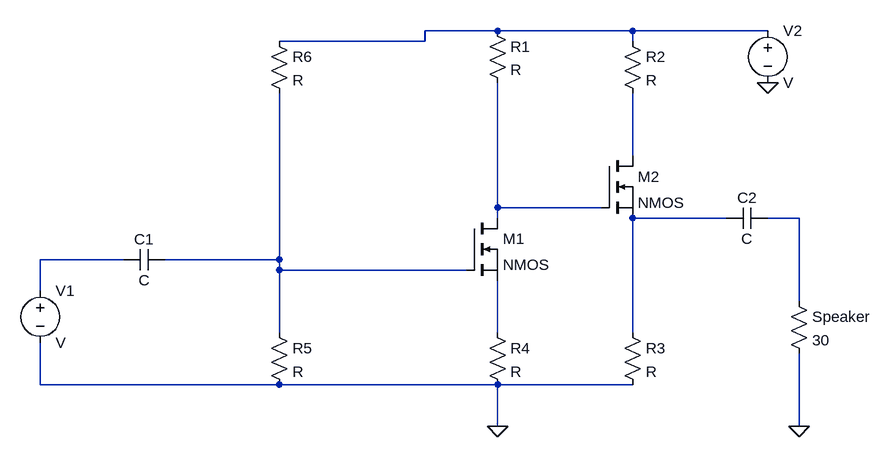
[diagram p0: schematic Amplifier_Draft_v1.asc]
Amplifier_Draft_v1.asc, the LTspice schematic file:
Version 4
SHEET 1 880 680
WIRE 176 -192 64 -192
WIRE 384 -192 176 -192
WIRE 592 -192 384 -192
WIRE 64 -176 64 -192
WIRE 64 -176 -160 -176
WIRE 384 -176 384 -192
WIRE 384 0 384 -96
WIRE 176 80 176 -112
WIRE 336 80 176 80
WIRE 176 96 176 80
WIRE 528 96 384 96
WIRE 640 96 592 96
WIRE -400 160 -528 160
WIRE -160 160 -160 -96
WIRE -160 160 -336 160
WIRE -160 176 -160 160
WIRE 128 176 -160 176
WIRE -528 208 -528 160
WIRE 640 224 640 96
WIRE -160 272 -160 176
WIRE 176 272 176 192
WIRE 384 272 384 96
WIRE -528 352 -528 288
WIRE -160 352 -528 352
WIRE 176 352 -160 352
WIRE 384 352 176 352
WIRE 176 416 176 352
WIRE 640 416 640 304
FLAG 176 416 0
FLAG 640 416 0
FLAG 592 -112 0
SYMBOL nmos 128 96 R0
SYMATTR InstName M1
SYMBOL nmos 336 0 R0
SYMATTR InstName M2
SYMBOL res 160 -208 R0
SYMATTR InstName R1
SYMBOL res 368 -192 R0
SYMATTR InstName R2
SYMBOL res 368 256 R0
SYMATTR InstName R3
SYMBOL res 160 256 R0
SYMATTR InstName R4
SYMBOL res -176 256 R0
SYMATTR InstName R5
SYMBOL res -176 -192 R0
SYMATTR InstName R6
SYMBOL cap -336 144 R90
WINDOW 0 0 32 VBottom 2
WINDOW 3 32 32 VTop 2
SYMATTR InstName C1
SYMBOL cap 592 80 R90
WINDOW 0 0 32 VBottom 2
WINDOW 3 32 32 VTop 2
SYMATTR InstName C2
SYMBOL voltage -528 192 R0
SYMATTR InstName V1
SYMBOL voltage 592 -208 R0
SYMATTR InstName V2
SYMBOL res 624 208 R0
SYMATTR InstName Speaker
SYMATTR Value 30

The netlist it stands for:
* Amplifier_Draft_v1.asc
M1 N003 N007 N008 N008 NMOS
M2 N002 N003 N004 N004 NMOS
R1 N001 N003 R
R2 N001 N002 R
R3 N004 0 R
R4 N008 0 R
R5 N007 0 R
R6 N001 N007 R
C1 N007 N006 C
C2 N005 N004 C
V1 N006 0 V
V2 N001 0 V
R§Speaker N005 0 30
.model NMOS NMOS
.model PMOS PMOS
.lib standard.mos
.backanno
.end